# Altium schematic sheet WakameBoard.SchDoc
size 569 x 459 mm
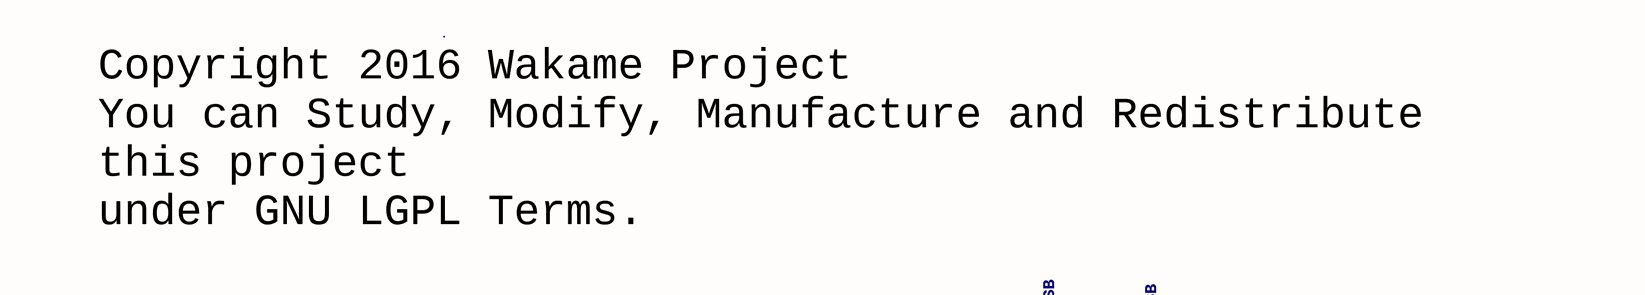
[diagram p0: WakameBoard.SchDoc, top left]
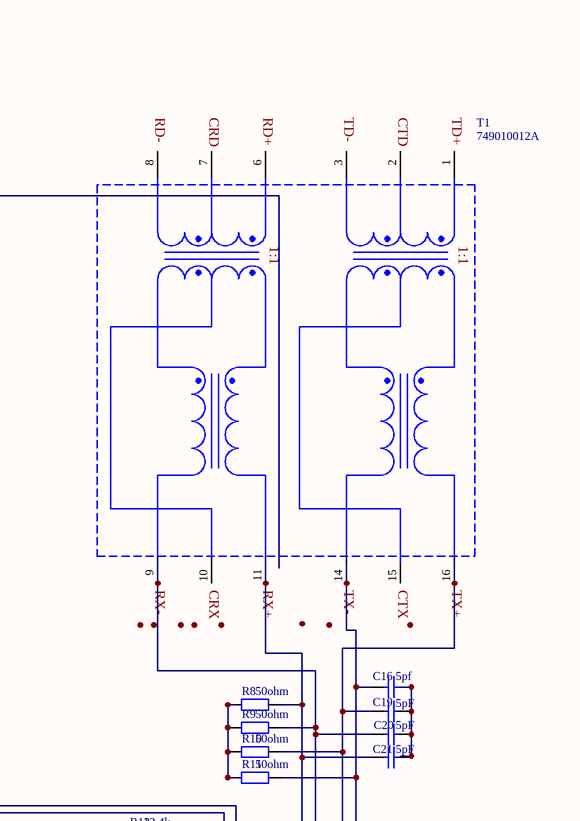
[diagram p1: WakameBoard.SchDoc, top right]
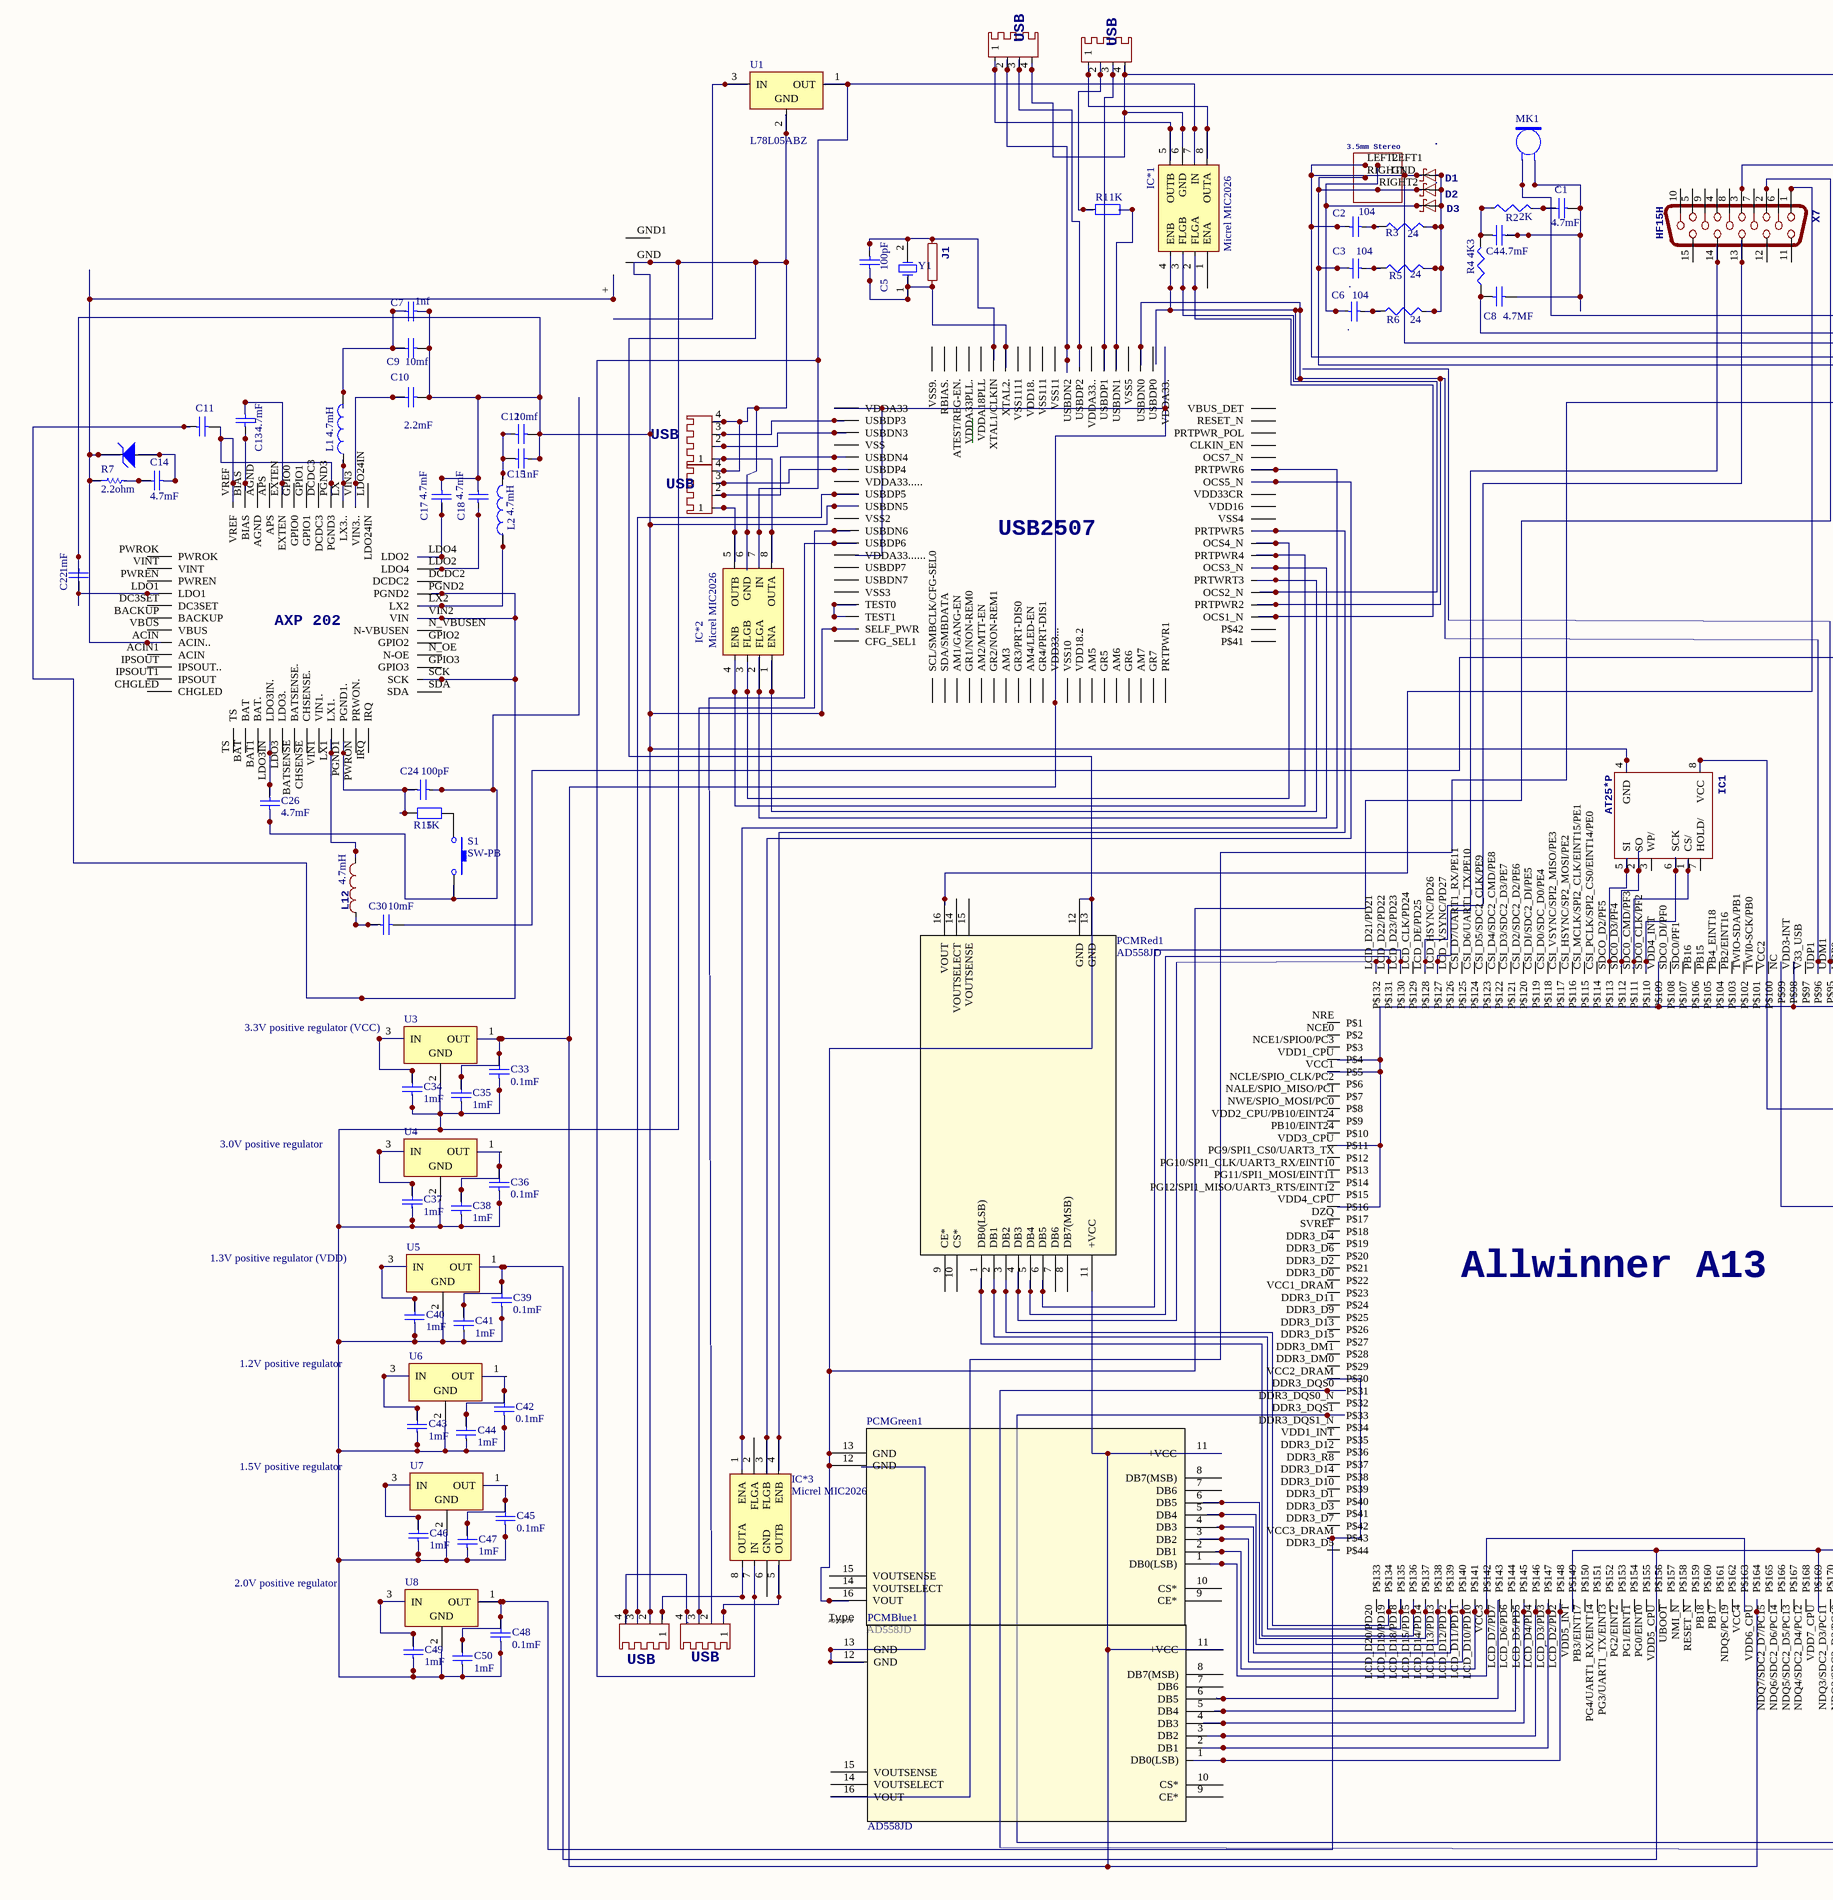
[diagram p2: WakameBoard.SchDoc, bottom left]
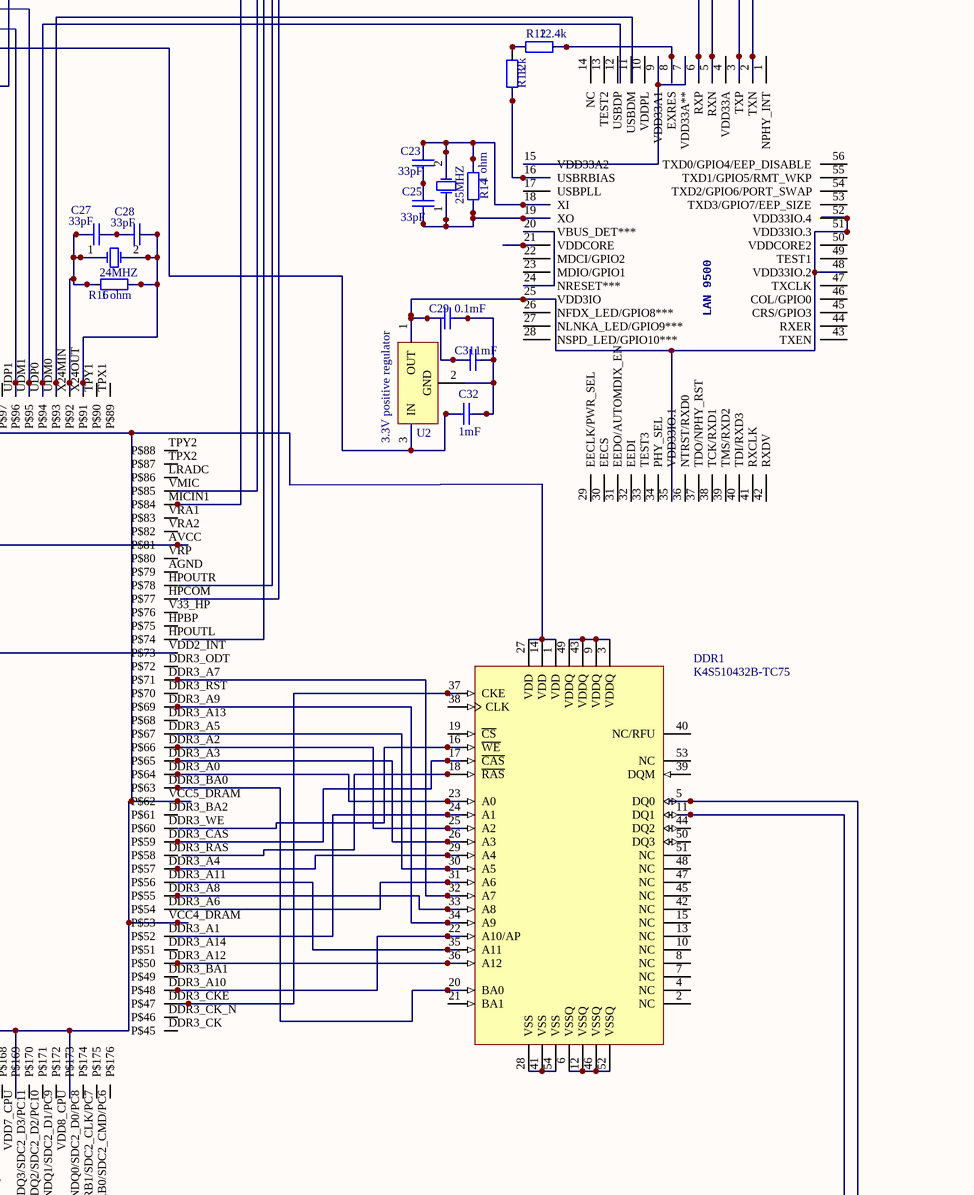
[diagram p3: WakameBoard.SchDoc, bottom right]

## Parts
Allwinner_A1  ALLWINNER-A13  [PG-LQFP-176-2]  (value not drawn)
AXP1  AXP202  [QFN48]  (value not drawn)
C1  value 4.7mF  [RAD-0.3]  (hidden comment: Cap)
C2  value 104  [RAD-0.3]  (hidden comment: .)
C3  .  value 104  [RAD-0.3]
C4  value 4.7mF  [RAD-0.3]  (hidden comment: Cap)
C5  value 100pF  [RAD-0.3]  (hidden comment: Cap)
C6  .  value 104  [RAD-0.3]
C7  value 1nf  [RAD-0.3]  (hidden comment: Cap)
C8  value 4.7MF  [RAD-0.3]  (hidden comment: Cap)
C9  value 10mf  [RAD-0.3]  (hidden comment: Cap)
C10  value 2.2mF  [RAD-0.3]  (hidden comment: Cap)
C11  Cap  [RAD-0.3]  (value not drawn)
C12  value 10mf  [RAD-0.3]  (hidden comment: Cap)
C13  value 4.7mF  [RAD-0.3]  (hidden comment: Cap)
C14  value 4.7mF  [RAD-0.3]  (hidden comment: Cap)
C15  value 1nF  [RAD-0.3]  (hidden comment: Cap)
C16  value 5pf  [RAD-0.3]  (hidden comment: Cap)
C17  value 4.7mF  [RAD-0.3]  (hidden comment: Cap)
C18  value 4.7mF  [RAD-0.3]  (hidden comment: Cap)
C19  value 5pF  [RAD-0.3]  (hidden comment: Cap)
C20  value 5pF  [RAD-0.3]  (hidden comment: Cap)
C21  value 5pF  [RAD-0.3]  (hidden comment: Cap)
C22  value 1mF  [RAD-0.3]  (hidden comment: Cap)
C23  value 33pF  [RAD-0.3]  (hidden comment: Cap)
C24  value 100pF  [RAD-0.3]  (hidden comment: Cap)
C25  value 33pF  [RAD-0.3]  (hidden comment: Cap)
C26  value 4.7mF  [RAD-0.3]  (hidden comment: Cap)
C27  value 33pF  [RAD-0.3]  (hidden comment: Cap)
C28  value 33pF  [RAD-0.3]  (hidden comment: Cap)
C29  value 0.1mF  [RAD-0.3]  (hidden comment: Cap)
C30  value 10mF  [RAD-0.3]  (hidden comment: Cap)
C31  value 1mF  [RAD-0.3]  (hidden comment: Cap)
C32  value 1mF  [RAD-0.3]  (hidden comment: Cap)
C33  value 0.1mF  [RAD-0.3]  (hidden comment: Cap)
C34  value 1mF  [RAD-0.3]  (hidden comment: Cap)
C35  value 1mF  [RAD-0.3]  (hidden comment: Cap)
C36  value 0.1mF  [RAD-0.3]  (hidden comment: Cap)
C37  value 1mF  [RAD-0.3]  (hidden comment: Cap)
C38  value 1mF  [RAD-0.3]  (hidden comment: Cap)
C39  value 0.1mF  [RAD-0.3]  (hidden comment: Cap)
C40  value 1mF  [RAD-0.3]  (hidden comment: Cap)
C41  value 1mF  [RAD-0.3]  (hidden comment: Cap)
C42  value 0.1mF  [RAD-0.3]  (hidden comment: Cap)
C43  value 1mF  [RAD-0.3]  (hidden comment: Cap)
C44  value 1mF  [RAD-0.3]  (hidden comment: Cap)
C45  value 0.1mF  [RAD-0.3]  (hidden comment: Cap)
C46  value 1mF  [RAD-0.3]  (hidden comment: Cap)
C47  value 1mF  [RAD-0.3]  (hidden comment: Cap)
C48  value 0.1mF  [RAD-0.3]  (hidden comment: Cap)
C49  value 1mF  [RAD-0.3]  (hidden comment: Cap)
C50  value 1mF  [RAD-0.3]  (hidden comment: Cap)
D1  .  [DIODE_DO35-7]
D2  .  [DIODE_DO35-7]
D3  .  [DIODE_DO35-7]
D4  D Zener  [DIODE-0.7]  (value not drawn)
DDR1  K4S510432B-TC75  [54_TSOP2_400AF_N]
IC1  AT25*P  [DIL08]
IC*1  Micrel MIC2026  [8uSOP]
IC*2  Micrel MIC2026  [8uSOP]
IC*3  Micrel MIC2026  [8uSOP]
J1  ZeroOhm  [0R/10]  (value not drawn)
L1  value 4.7mH  [0402-A]  (hidden comment: Inductor)
L2  value 4.7mH  [0402-A]  (hidden comment: Inductor)
L12  Inductance: 4.7mH  [L8530M]  (hidden comment: L-USL8530M)
LAN1  LAN9500  [QFN56]  (value not drawn)
MK1  Mic2  [ST-3150-5N]  (value not drawn)
PCMBlue1  AD558JD  [DIP16]
PCMGreen1  AD558JD  [DIP16]
PCMRed1  AD558JD  [DIP16]
R1  value 1K  [AXIAL-0.4]  (hidden comment: Res2)
R2  value 2K  [AXIAL-0.3]  (hidden comment: Res1)
R3  value 24  [J1-0603]  (hidden comment: Res3)
R4  value 4K3  [J1-0603]  (hidden comment: Res3)
R5  value 24  [J1-0603]  (hidden comment: Res3)
R6  value 24  [J1-0603]  (hidden comment: Res3)
R7  value 2.2ohm  [AXIAL-0.3]  (hidden comment: Res1)
R8  value 50ohm  [AXIAL-0.4]  (hidden comment: Res2)
R9  value 50ohm  [AXIAL-0.4]  (hidden comment: Res2)
R10  value 50ohm  [AXIAL-0.4]  (hidden comment: Res2)
R11  value 50ohm  [AXIAL-0.4]  (hidden comment: Res2)
R12  value 12.4k  [AXIAL-0.4]  (hidden comment: Res2)
R13  value 12k  [AXIAL-0.4]  (hidden comment: Res2)
R14  value 1 ohm  [AXIAL-0.4]  (hidden comment: Res2)
R15  value 1K  [AXIAL-0.4]  (hidden comment: Res2)
R16  value 1 ohm  [AXIAL-0.4]  (hidden comment: Res2)
S1  SW-PB  [SPST-2]
T1  749010012A  [749010012A]
U1  L78L05ABZ  [TO92]
U2  3.3V positive regulator  [MAX247]
U3  3.3V positive regulator (VCC)  [MAX247]
U4  3.0V positive regulator  [MAX247]
U5  1.3V positive regulator (VDD)  [MAX247]
U6  1.2V positive regulator  [MAX247]
U7  1.5V positive regulator  [MAX247]
U8  2.0V positive regulator  [MAX247]
U$1  PWR  [SCD-014-A]  (value not drawn)
U$2  USB2507  [TQFP80]
U$3  35MMSTEREOJACK  [PG203J]  (value not drawn)
X1  USB-A003  [USB-A003]  (value not drawn)
X2  USB-A003  [USB-A003]  (value not drawn)
X3  USB-A003  [USB-A003]  (value not drawn)
X4  USB-A003  [USB-A003]  (value not drawn)
X5  USB-A003  [USB-A003]  (value not drawn)
X6  USB-A003  [USB-A003]  (value not drawn)
X7  HF15H  [HDF15H]
Y1  XTAL  [R38]  (value not drawn)
Y2  Frequency: 25MHZ  [R38]  (hidden comment: XTAL)
Y3  Frequency: 24MHZ  [R38]  (hidden comment: XTAL)

## Nets
NetAllwinner_A1_AVCC: Allwinner_A1.AVCC(P$81) IC1.8(VCC)
NetAllwinner_A1_DDR3_A0: Allwinner_A1.DDR3_A0(P$64) DDR1.23(A0)
NetAllwinner_A1_DDR3_A1: Allwinner_A1.DDR3_A1(P$52) DDR1.24(A1)
NetAllwinner_A1_DDR3_A2: Allwinner_A1.DDR3_A2(P$66) DDR1.25(A2)
NetAllwinner_A1_DDR3_A3: Allwinner_A1.DDR3_A3(P$65) DDR1.26(A3)
NetAllwinner_A1_DDR3_A4: Allwinner_A1.DDR3_A4(P$57) DDR1.29(A4)
NetAllwinner_A1_DDR3_A5: Allwinner_A1.DDR3_A5(P$67) DDR1.30(A5)
NetAllwinner_A1_DDR3_A6: Allwinner_A1.DDR3_A6(P$54) DDR1.31(A6)
NetAllwinner_A1_DDR3_A7: Allwinner_A1.DDR3_A7(P$71) DDR1.32(A7)
NetAllwinner_A1_DDR3_A8: Allwinner_A1.DDR3_A8(P$55) DDR1.33(A8)
NetAllwinner_A1_DDR3_A9: Allwinner_A1.DDR3_A9(P$69) DDR1.34(A9)
NetAllwinner_A1_DDR3_A10: Allwinner_A1.DDR3_A10(P$48) DDR1.22(A10/AP)
NetAllwinner_A1_DDR3_A11: Allwinner_A1.DDR3_A11(P$56) DDR1.35(A11)
NetAllwinner_A1_DDR3_A12: Allwinner_A1.DDR3_A12(P$50) DDR1.36(A12)
NetAllwinner_A1_DDR3_BA0: Allwinner_A1.DDR3_BA0(P$63) DDR1.20(BA0)
NetAllwinner_A1_DDR3_CAS: Allwinner_A1.DDR3_CAS(P$59) DDR1.17(~{CAS})
NetAllwinner_A1_DDR3_CKE: Allwinner_A1.DDR3_CKE(P$47) DDR1.37(CKE)
NetAllwinner_A1_DDR3_DQS0: Allwinner_A1.DDR3_DQS0(P$31) DDR1.5(DQ0)
NetAllwinner_A1_DDR3_DQS1: Allwinner_A1.DDR3_DQS1(P$33) DDR1.11(DQ1)
NetAllwinner_A1_LCD_D2/PD2: Allwinner_A1.LCD_D2/PD2(P$148) PCMBlue1.1(DB0(LSB))
NetAllwinner_A1_LCD_D3/PD3: Allwinner_A1.LCD_D3/PD3(P$147) PCMBlue1.2(DB1)
NetAllwinner_A1_LCD_D4/PD4: Allwinner_A1.LCD_D4/PD4(P$146) PCMBlue1.3(DB2)
NetAllwinner_A1_LCD_D5/PD5: Allwinner_A1.LCD_D5/PD5(P$145) PCMBlue1.4(DB3)
NetAllwinner_A1_LCD_D10/PD10: Allwinner_A1.LCD_D10/PD10(P$141) PCMGreen1.2(DB1)
NetAllwinner_A1_LCD_D11/PD11: Allwinner_A1.LCD_D11/PD11(P$140) PCMGreen1.3(DB2)
NetAllwinner_A1_LCD_D12/PD12: Allwinner_A1.LCD_D12/PD12(P$139) PCMGreen1.4(DB3)
NetAllwinner_A1_LCD_D13/PD13: Allwinner_A1.LCD_D13/PD13(P$138) PCMGreen1.5(DB4)
NetAllwinner_A1_LCD_D14/PD14: Allwinner_A1.LCD_D14/PD14(P$137) PCMGreen1.6(DB5)
NetAllwinner_A1_LCD_D15/PD15: Allwinner_A1.LCD_D15/PD15(P$136) PCMRed1.1(DB0(LSB))
NetAllwinner_A1_LCD_D18/PD18: Allwinner_A1.LCD_D18/PD18(P$135) PCMRed1.2(DB1)
NetAllwinner_A1_LCD_D19/PD19: Allwinner_A1.LCD_D19/PD19(P$134) PCMRed1.3(DB2)
NetAllwinner_A1_LCD_D21/PD21: Allwinner_A1.LCD_D21/PD21(P$132) PCMRed1.4(DB3)
NetAllwinner_A1_LCD_D22/PD22: Allwinner_A1.LCD_D22/PD22(P$131) PCMRed1.5(DB4)
NetAllwinner_A1_LCD_D23/PD23: Allwinner_A1.LCD_D23/PD23(P$130) PCMRed1.6(DB5)
NetAllwinner_A1_LCD_DE/PD25: Allwinner_A1.LCD_DE/PD25(P$128) X7.13
NetAllwinner_A1_LCD_HSYNC/PD26: Allwinner_A1.LCD_HSYNC/PD26(P$127) X7.14
NetAllwinner_A1_MICIN1: Allwinner_A1.MICIN1(P$84) MK1.1
NetAllwinner_A1_SDC0_CLK/PF2: Allwinner_A1.SDC0_CLK/PF2(P$110) IC1.6(SCK)
NetAllwinner_A1_SDC0_CMD/PF3: Allwinner_A1.SDC0_CMD/PF3(P$111) IC1.1(CS/)
NetAllwinner_A1_SDC0_D3/PF4: Allwinner_A1.SDC0_D3/PF4(P$112) IC1.2(SO)
NetAllwinner_A1_SDCO_D2/PF5: Allwinner_A1.SDCO_D2/PF5(P$113) IC1.5(SI)
NetAllwinner_A1_UDP1: Allwinner_A1.UDP1(P$96) IC*1.4(ENB) U$2.PRTPWR3(PRTPWR2) U$2.USBDN0
NetAllwinner_A1_VCC1: Allwinner_A1.VCC1(P$5) Allwinner_A1.VCC4_DRAM(P$53) Allwinner_A1.VCC5_DRAM(P$62) Allwinner_A1.VDD3-INT(P$98) Allwinner_A1.VDD4_INT(P$109) Allwinner_A1.VDD5_INT(P$149) Allwinner_A1.VDD7_CPU(P$169) Allwinner_A1.VDD8_CPU(P$173) C39.2 C41.2 DDR1.1(VDD) DDR1.14(VDD) DDR1.27(VDD) U5.1(OUT)
NetAllwinner_A1_VCC2_DRAM: Allwinner_A1.VCC2_DRAM(P$30) Allwinner_A1.VCC3_DRAM(P$43) C48.2 C50.2 U8.1(OUT)
NetAllwinner_A1_VCC3: Allwinner_A1.VCC3(P$142) Allwinner_A1.VCC4(P$163) PCMGreen1.1(DB0(LSB))
NetAllwinner_A1_VDD6_CPU: Allwinner_A1.VDD6_CPU(P$164) C33.2 C35.2 PCMBlue1.11(+VCC) PCMGreen1.11(+VCC) PCMRed1.11(+VCC) U3.1(OUT) U$2.VDD33(VDDA33) U$2.VDD33.3(VDD33...) U$2.VDDA33.4(VDDA33.)
NetAllwinner_A1_VMIC: Allwinner_A1.VMIC(P$85) C8.1 R4.1
NetAllwinner_A1_X24MIN: Allwinner_A1.X24MIN(P$92) C27.1 R16.1 Y3.1(OSC1)
NetAllwinner_A1_X24OUT: Allwinner_A1.X24OUT(P$91) C28.2 R16.2 Y3.2(OSC2)
NetAXP1_ACIN: AXP1.ACIN(ACIN..) D4.2(K) R7.1 U$1.+
NetAXP1_BIAS: AXP1.BIAS C13.1
NetAXP1_EXTEN: AXP1.EXTEN C13.2
NetAXP1_LDO1: AXP1.LDO1 C7.2 C9.2 C10.2 C12.2 C15.2 C17.2 C18.2 C22.1 C22.2 C33.1 C34.2 C35.1 C36.1 C37.2 C38.1 C39.1 C40.2 C41.1 C42.1 C43.2 C44.1 C45.1 C46.2 C47.1 C48.1 C49.2 C50.1 IC1.4(GND) IC*2.6(GND) PCMGreen1.12(GND) PCMGreen1.13(GND) PCMGreen1.16(VOUT) PCMRed1.12(GND) PCMRed1.13(GND) U1.2(GND) U3.2(GND) U4.2(GND) U5.2(GND) U6.2(GND) U7.2(GND) U8.2(GND) U$1.GND U$2.SELF_PWR U$2.USBDN5 X2.2 X3.4 X6.4 X7.2
NetAXP1_LDO2: AXP1.LDO2(LDO4) C18.1
NetAXP1_LDO3IN: AXP1.LDO3IN(LDO3IN.) C26.1
NetAXP1_LDO4: AXP1.LDO4(LDO2) C17.1
NetAXP1_LX: AXP1.LX(LX3..) L1.1
NetAXP1_LX1: AXP1.LX1(LX1.) L12.2
NetAXP1_LX2: AXP1.LX2 L2.1
NetAXP1_PGND1: AXP1.PGND1(PGND1.) C24.1 R15.1
NetAXP1_PGND2: AXP1.PGND2 AXP1.SCK AXP1.VIN2(VIN) C11.2
NetAXP1_PGND3: AXP1.PGND3 AXP1.VREF C11.1
NetAXP1_VIN3: AXP1.VIN3(VIN3..) C10.1
NetC1_1: C1.1 R2.2
NetC1_2: C1.2 C4.2 C8.2 MK1.2
NetC2_1: C2.1 D1.C(A) U$3.LEFT2(P$3)
NetC2_2: C2.2 R3.1
NetC3_1: C3.1 D3.C(A) U$3.RIGHT1(P$4) U$3.RIGHT2(P$5)
NetC3_2: C3.2 R5.1
NetC4_1: C4.1 R2.1 R4.2
NetC5_1: C5.1 J1.2 U$2.XTAL2(XTAL2.) Y1.1(OSC1)
NetC5_2: C5.2 J1.1 U$2.XTAL1/CLKIN Y1.2(OSC2)
NetC6_1: C6.1 D2.C(A)
NetC6_2: C6.2 R6.1
NetC7_1: C7.1 C9.1 L1.2
NetC12_1: C12.1 C15.1 L2.2
NetC14_1: C14.1 R7.2
NetC14_2: C14.2 D4.1(A)
NetC16_1: C16.1 LAN1.2(TXN) R11.2 T1.14(TX-)
NetC16_2: C16.2 C19.2 C20.2 C21.2
NetC19_1: C19.1 LAN1.3(TXP) R10.2 T1.16(TX+)
NetC20_1: C20.1 LAN1.5(RXN) R9.2 T1.9(RX-)
NetC21_1: C21.1 LAN1.6(RXP) R8.2 T1.11(RX+)
NetC23_1: C23.1 C25.2
NetC23_2: C23.2 LAN1.18(XI) R14.2 Y2.2(OSC2)
NetC24_2: C24.2 C26.2 S1.2
NetC25_1: C25.1 LAN1.19(XO) R14.1 Y2.1(OSC1)
NetC27_2: C27.2 C28.1
NetC29_1: C29.1 C31.1 C32.2 U2.2(GND)
NetC29_2: C29.2 C31.2 LAN1.25(VDD3IO) LAN1.35(VDD33IO.1) LAN1.51(VDD33IO.3) LAN1.52(VDD33IO.4) U2.1(OUT)
NetC30_1: C30.1 L12.1
NetC30_2: C30.2 C32.1 U2.3(IN)
NetC34_1: C34.1 U3.3(IN)
NetC36_2: C36.2 C38.2
NetC37_1: C37.1 U4.3(IN)
NetC40_1: C40.1 U5.3(IN)
NetC42_2: C42.2 C44.2
NetC43_1: C43.1 U6.3(IN)
NetC45_2: C45.2 C47.2
NetC46_1: C46.1 U7.3(IN)
NetC49_1: C49.1 U8.3(IN)
NetD1_A: D1.A(C) D2.A(C) D3.A(C) R3.2 R5.2 R6.2
NetDDR1_3: DDR1.3(VDDQ) DDR1.9(VDDQ) DDR1.43(VDDQ) DDR1.49(VDDQ)
NetDDR1_6: DDR1.6(VSSQ) DDR1.12(VSSQ) DDR1.46(VSSQ) DDR1.52(VSSQ)
NetDDR1_28: DDR1.28(VSS) DDR1.41(VSS) DDR1.54(VSS)
NetIC*1_2: IC*1.2(FLGA) U$2.OCS2_N(OCS1_N)
NetIC*1_3: IC*1.3(FLGB) U$2.OCS3_N(OCS2_N)
NetIC*1_5: IC*1.5(OUTB) X1.1
NetIC*1_6: IC*1.6(GND) X1.4 X4.4
NetIC*1_7: IC*1.7(IN) IC*2.7(IN) IC*3.7(IN) U1.1(OUT)
NetIC*1_8: IC*1.8(OUTA) X4.1
NetIC*2_1: IC*2.1(ENA) U$2.PRTPWR4(PRTWRT3)
NetIC*2_2: IC*2.2(FLGA) U$2.OCS4_N(OCS3_N)
NetIC*2_3: IC*2.3(FLGB) U$2.VSS5(OCS4_N)
NetIC*2_4: IC*2.4(ENB) U$2.PRTPWR5(PRTPWR4)
NetIC*2_5: IC*2.5(OUTB) X3.1
NetIC*2_8: IC*2.8(OUTA) X6.1
NetIC*3_1: IC*3.1(ENA) U$2.PRTPWR7(PRTPWR6)
NetIC*3_3: IC*3.3(FLGB) U$2.OCS6_N(OCS5_N)
NetIC*3_4: IC*3.4(ENB) U$2.VDD18.2(PRTPWR5)
NetIC*3_5: IC*3.5(OUTB) X5.1
NetIC*3_8: IC*3.8(OUTA) X2.1
NetLAN1_7: LAN1.7(VDD33A**) LAN1.9(VDD33A1) LAN1.15(VDD33A2)
NetLAN1_8: LAN1.8(EXRES) R12.2
NetLAN1_16: LAN1.16(USBRBIAS) R13.1
NetLAN1_20: LAN1.20(VBUS_DET***) LAN1.24(NRESET***)
NetPCMBlue1_12: PCMBlue1.12(GND) PCMBlue1.13(GND)
NetPCMBlue1_16: PCMBlue1.16(VOUT) X7.3
NetPCMRed1_16: PCMRed1.16(VOUT) X7.1
NetR1_1: R1.1 X4.2
NetR1_2: R1.2 U$2.USBDN1
NetR8_1: R8.1 R9.1 R10.1 R11.1
NetR12_1: R12.1 R13.2
NetR15_2: R15.2 S1.1
NetU$2_TEST0: U$2.TEST0 U$2.TEST1
NetU$2_USBDN2: U$2.USBDN2 X1.2
NetU$2_USBDN3: U$2.USBDN3 X6.2
NetU$2_USBDN4: U$2.USBDN4 X3.2
NetU$2_USBDN6: U$2.USBDN6 X5.3
NetU$2_USBDP1: U$2.USBDP1 X4.3
NetU$2_USBDP2: U$2.USBDP2 X1.3
NetU$2_USBDP3: U$2.USBDP3 X6.3
NetU$2_USBDP4: U$2.USBDP4 X3.3
NetU$2_USBDP5: U$2.USBDP5 X2.3
NetU$2_USBDP6: U$2.USBDP6 X5.2
NetX2_4: X2.4 X5.4

Not connected (* = marked no-connect by the designer): Allwinner_A1 AGND(P$79) CSI_D0/SDC_D0/PE4(P$118) CSI_D2/SDC2_D2/PE6(P$120) CSI_D3/SDC2_D3/PE7(P$121) CSI_D4/SDC2_CMD/PE8(P$122) CSI_D5/SDC2_CLK/PE9(P$123) CSI_D6/UART1_TX/PE10(P$124) CSI_D7/UART1_RX/PE11(P$125) CSI_DI/SDC2_DI/PE5(P$119) CSI_HSYNC/SP2_MOSI/PE2(P$116) CSI_MCLK/SPI2_CLK/EINT15/PE1(P$115) CSI_PCLK/SPI2_CS0/EINT14/PE0(P$114) CSI_VSYNC/SPI2_MISO/PE3(P$117) DDR3_A13(P$68) DDR3_A14(P$51) DDR3_BA1(P$49) DDR3_BA2(P$61) DDR3_CK(P$45) DDR3_CK_N(P$46) DDR3_D0(P$22) DDR3_D1(P$40) DDR3_D2(P$21) DDR3_D3(P$41) DDR3_D4(P$19) DDR3_D5(P$44) DDR3_D6(P$20) DDR3_D7(P$42) DDR3_D9(P$25) DDR3_D10(P$39) DDR3_D11(P$24) DDR3_D12(P$36) DDR3_D13(P$26) DDR3_D14(P$38) DDR3_D15(P$27) DDR3_DM0(P$29) DDR3_DM1(P$28) DDR3_DQS0_N(P$32) DDR3_DQS1_N(P$34) DDR3_ODT(P$72) DDR3_R8(P$37) DDR3_RAS(P$58) DDR3_RST(P$70) DDR3_WE(P$60) DZQ(P$17) HPBP(P$75) HPCOM(P$77) HPOUTL(P$74) HPOUTR(P$78) LCD_CLK/PD24(P$129) LCD_D6/PD6(P$144) LCD_D7/PD7(P$143) LCD_D20/PD20(P$133) LCD_VSYNC/PD27(P$126) LRADC(P$86) NALE/SPIO_MISO/PCI(P$7) NC(P$99) NCE0(P$2) NCE1/SPIO0/PC3(P$3) NCLE/SPIO_CLK/PC2(P$6) NDQ0/SDC2_D0/PC8(P$174) NDQ1/SDC2_D1/PC9(P$172) NDQ2/SDC2_D2/PC10(P$171) NDQ3/SDC2_D3/PC11(P$170) NDQ4/SDC2_D4/PC12(P$168) NDQ5/SDC2_D5/PC13(P$167) NDQ6/SDC2_D6/PC14(P$166) NDQ7/SDC2_D7/PC15(P$165) NDQS/PC19(P$162) NMI_N(P$158) NRB0/SDC2_CMD/PC6(P$176) NRB1/SDC2_CLK/PC7(P$175) NRE(P$1) NWE/SPIO_MOSI/PC0(P$8) PB2/EINT16(P$103) PB3/EINT17(P$150) PB4_EINT18(P$104) PB10/EINT24(P$10) PB15(P$105) PB16(P$106) PB17(P$161) PB18(P$160) PG0/EINT0(P$155) PG1/EINT1(P$154) PG2/EINT2(P$153) PG3/UART1_TX/EINT3(P$152) PG4/UART1_RX/EINT14(P$151) PG9/SPI1_CS0/UART3_TX(P$12) PG10/SPI1_CLK/UART3_RX/EINT10(P$13) PG11/SPI1_MOSI/EINT11(P$14) PG12/SPI1_MISO/UART3_RTS/EINT12(P$15) RESET_N(P$159) SDC0/PF1(P$107) SDC0_DI/PF0(P$108) SVREF(P$18) TPX1(P$89) TPX2(P$87) TPY1(P$90) TPY2(P$88) TWI0-SCK/PB0(P$101) TWIO-SDA/PB1(P$102) UBOOT(P$157) UDM0(P$93) UDM1(P$95) UDP0(P$94) V33_HP(P$76) V33_USB(P$97) VCC1_DRAM(P$23) VCC2(P$100) VDD1_CPU(P$4) VDD1_INT(P$35) VDD2_CPU/PB10/EINT24(P$9) VDD2_INT(P$73) VDD3_CPU(P$11) VDD4_CPU(P$16) VDD5_CPU(P$156) VRA1(P$83) VRA2(P$82) VRP(P$80); AXP1 ACIN1(ACIN) AGND APS BACKUP BAT BAT1(BAT.) BATSENSE(BATSENSE.) CHGLED CHSENSE(CHSENSE.) DC3SET DCDC2 DCDC3 GPIO0 GPIO1 GPIO2 GPIO3 IPSOUT(IPSOUT..) IPSOUT1(IPSOUT) IRQ LDO3(LDO3.) LDO24IN N_OE(N-OE) N_VBUSEN(N-VBUSEN) PWREN PWROK PWRON(PRWON.) SDA TS VBUS VIN1(VIN1.) VINT; DDR1 2(NC) 4(NC) 7(NC) 8(NC) 10(NC) 13(NC) 15(NC) 16(~{WE}) 18(~{RAS}) 19(~{CS}) 21(BA1) 38(CLK) 39(DQM) 40(NC/RFU) 42(NC) 44(DQ2) 45(NC) 47(NC) 48(NC) 50(DQ3) 51(NC) 53(NC); IC1 3(WP/) 7(HOLD/); IC*1 1(ENA); IC*3 2(FLGA) 6(GND); LAN1 1(NPHY_INT) 4(VDD33A) 10(VDDPL) 11(USBDM) 12(USBDP) 13(TEST2) 14(NC) 17(USBPLL) 21(VDDCORE) 22(MDCI/GPIO2) 23(MDIO/GPIO1) 26(NFDX_LED/GPIO8***) 27(NLNKA_LED/GPIO9***) 28(NSPD_LED/GPIO10***) 29(EECLK/PWR_SEL) 30(EECS) 31(EEDO/AUTOMDIX_EN) 32(EEDI) 33(TEST3) 34(PHY_SEL) 36(NTRST/RXD0) 37(TDO/NPHY_RST) 38(TCK/RXD1) 39(TMS/RXD2) 40(TDI/RXD3) 41(RXCLK) 42(RXDV) 43(TXEN) 44(RXER) 45(CRS/GPIO3) 46(COL/GPIO0) 47(TXCLK) 48(VDD33IO.2) 49(TEST1) 50(VDDCORE2) 53(TXD3/GPIO7/EEP_SIZE) 54(TXD2/GPIO6/PORT_SWAP) 55(TXD1/GPIO5/RMT_WKP) 56(TXD0/GPIO4/EEP_DISABLE); PCMBlue1 5(DB4) 6(DB5) 7(DB6) 8(DB7(MSB)) 9(CE*) 10(CS*) 14(VOUTSELECT) 15(VOUTSENSE); PCMGreen1 7(DB6) 8(DB7(MSB)) 9(CE*) 10(CS*) 14(VOUTSELECT) 15(VOUTSENSE); PCMRed1 7(DB6) 8(DB7(MSB)) 9(CE*) 10(CS*) 14(VOUTSELECT) 15(VOUTSENSE); T1 1(TD+) 2(CTD) 3(TD-) 6(RD+) 7(CRD) 8(RD-) 10(CRX) 15(CTX); U1 3(IN); U4 1(OUT); U6 1(OUT); U7 1(OUT); U$1 GND1; U$2 AM1/GANG_EN(AM1/GANG-EN) AM2/MTT_EN(AM2/MTT-EN) AM3 AM4/LED_EN(AM4/LED-EN) AM5 AM6 AM7 ATEST/REG_EN(ATEST/REG-EN.) CFG_SEL1 CLKIN_EN GR1/NON_REM0(GR1/NON-REM0) GR2_NON_REM1(GR2/NON-REM1) GR3/PRT_DIS0(GR3/PRT-DIS0) GR4/PRT_DIS1(GR4/PRT-DIS1) GR5 GR6 GR7 OCS1_N(P$41) OCS5_N(VDD16) OCS7_N PRTPWR1 PRTPWR2(P$42) PRTPWR6(VDD33CR) PRTPWR_POL RBIAS(RBIAS.) RESET_N SCL/SMBCLK/CFG_SEL0(SCL/SMBCLK/CFG-SEL0) SDA/SMBDATA USBDN7 USBDP0 USBDP7 VBUS_DET VDD18(VDD18.2) VDD18.3(VDD18.) VDD33CR(VSS4) VDDA3.1(VDDA33..) VDDA18/PLL(VDDA18PLL) VDDA33(VDDA33.....) VDDA33.2(VDDA33......) VDDA33/PLL(VDDA33PLL.) VSS VSS0(VSS9.) VSS1(VSS2) VSS3 VSS4(VSS10) VSS6(VSS5) VSS7(VSS11) VSS8(VSS111) VSS9(VSS1111); U$3 GND(P$1) LEFT1(P$2); X7 4 5 6 7 8 9 10 11 12 15

## Notes on the sheet
- Copyright 2016 Wakame Project
  You can Study, Modify, Manufacture and Redistribute this project
  under GNU LGPL Terms.
- Text
- (in symbol 749010012A) 1:1

## Library data of the parts
AXP1 = AXP202: Allwinner a13 pwr ic; AXP 202: AXP 202
C1-C10 C12-C50 = Cap: Capacitor; Published: 8-Jun-2000; LatestRevisionDate: 17-Jul-2002; LatestRevisionNote: Re-released for DXP Platform.; PackageReference: RAD-0.3; Publisher: Altium Limited
C11 = Cap: Capacitor; Value: 100pF; Published: 8-Jun-2000; LatestRevisionDate: 17-Jul-2002; LatestRevisionNote: Re-released for DXP Platform.; PackageReference: RAD-0.3; Publisher: Altium Limited
D1-D3 = SCHOTTKY-DIODEDO35-7: SPICEMODEL: NONE; SPICEPREFIX: D; SPICETYPE: diode
D4 = D Zener: Zener Diode; Published: 8-Jun-2000; LatestRevisionDate: 17-Jul-2002; LatestRevisionNote: Re-released for DXP Platform.; PackageReference: DIODE-0.7; Publisher: Altium Limited
DDR1 = K4S510432B-TC75: 512Mb Synchronous High Data Rate DRAM, 32Mb x 4Bit x 4 Banks, 54-Pin TSOP; Frequency: 133MHz (max); RowAddress: A0-A12; ColumnAddress: A0-A9, A11, A12; Published: 11-Oct-2004; LatestRevisionDate: 13-Apr-2006; LatestRevisionNote: IPC-7351 Footprint Added.; DatasheetVersion: rev1.1, Feb-2004; PackageVersion: Aug-2004; PackageReference: 54_TSOP2_400AF; Publisher: Altium Limited; PackageDescription: 54-Pin Small Outline Package 0.8 mm Pitch; ComponentLink1Description: Manufacturer Link; ComponentLink1URL: http://www.samsung.com; ComponentLink2Description: Datasheet; ComponentLink2URL: http://www.samsung.com/Products/Semiconductor/DRAM/SDRAM/SDRAMcomponent/512Mbit/K4S510432B/ds_sdr_512mb_b-die_x4x8x16_11.pdf
IC1 = AT25*P: SPI bus serial <B>EEPROM</B>; MPN: CAT25040LI-G; OC_FARNELL: 1718045; OC_NEWARK: 06R0588
IC*1-IC*3 = MIC2026: Micrel MIC2026 Dual-Channel Power Distribution Switch
J1 = 0R: Bridge 0R 10mm; 0Û: 0Û
L1 L2 = Inductor: Code_IEC: 1005; Published: 8-Jun-2000; LatestRevisionDate: 17-Jul-2002; LatestRevisionNote: Re-released for DXP Platform.; PackageReference: 0402-A; Publisher: Altium Limited; Code_JEITA: 0402
L12 = L-USL8530M: <B>INDUCTOR</B>, American symbol
MK1 = Mic2: Microphone; Published: 24-Mar-1999; LatestRevisionDate: 17-Jul-2002; LatestRevisionNote: Re-released for DXP Platform.; PackageReference: PIN2; Publisher: Altium Limited
PCMBlue1 PCMGreen1 PCMRed1 = AD558JD: Imported; Manufacturer_Part_Number: AD558JD; Vendor: Vendor; Value: Value; Type: Type; RefDes: Refdes
R1 R8-R16 = Res2: Resistor; Published: 8-Jun-2000; LatestRevisionDate: 17-Jul-2002; LatestRevisionNote: Re-released for DXP Platform.; PackageReference: AXIAL-0.4; Publisher: Altium Limited
R2-R6 = Res3: Resistor; Published: 8-Jun-2000; LatestRevisionDate: 04-Mar-2005; LatestRevisionNote: PCB Footprint replaced.; PackageReference: J1-0603; Publisher: Altium Limited
R7 = Res1: Resistor; Published: 8-Jun-2000; LatestRevisionDate: 17-Jul-2002; LatestRevisionNote: Re-released for DXP Platform.; PackageReference: AXIAL-0.3; Publisher: Altium Limited
S1 = SW-PB: Switch; Published: 24-Mar-1999; LatestRevisionDate: 17-Jul-2002; LatestRevisionNote: Re-released for DXP Platform.; PackageReference: SPST-2; Publisher: Altium Limited
T1 = 749010012A: 10/100 Base-T SMD Transformer 1 Port; Manufacturer: Wurth Elektronik; ComponentLink1Description: Manufacturer; ComponentLink1URL: http://www.we-online.com; ComponentLink2Description: Datasheet; ComponentLink2URL: http://katalog.we-online.de/pbs/datasheet/749010012A.pdf; Created by: Baojun Chen; Created Date: 27.Oct.2015; partNo: 749010012A
U1-U8 = L78L05ABZ: Positive Voltage Regulator; Published: 24-Aug-2001; LatestRevisionDate: 17-Jul-2002; LatestRevisionNote: Re-released for DXP Platform.; DatasheetVersion: Feb-1999; PackageReference: TO92; Publisher: Altium Limited; PackageDescription: TO, Flat Index; 3 In-Line, Axial Leads; Body Dia. 4.8mm; Leads 0.51 x 0.51 mm (max); ComponentLink1Description: Manufacturer Link
  U1: ComponentLink1URL: http://www.st.com/
  U2-U8: ComponentLink1URL: Linear Power
U$1 = PWR: Main Power Jack
U$2 = USB2507: usb 2507 hub on chiip; USB2507: USB2507
X1-X6 = USB-A003: <b>USB connector</b>; OC_FARNELL: unknown; OC_NEWARK: unknown; USB: USB
X7 = HF15H: <b>SUB-D</b>; OC_FARNELL: unknown; OC_NEWARK: unknown
Y1-Y3 = XTAL: Crystal Oscillator; Published: 8-Jun-2000; LatestRevisionDate: 17-Jul-2002; LatestRevisionNote: Re-released for DXP Platform.; PackageReference: R38; Publisher: Altium Limited
Allwinner_A1 = ALLWINNER-A13: Allwinner A13: Allwinner A13
LAN1 = LAN9500: LAN 9500: LAN 9500
U$3 = 35MMSTEREOJACK: 3.5mm Stereo: 3.5mm Stereo